# Altium project iso_simucam.PrjPCB (part 2 of 2)

## Sheet iso_power.SchDoc: Iso Power
size A3; Author: Cassio Berni; DrawnBy: CCB; Revision: 1_01; SheetNumber: 4; SheetTotal: 4
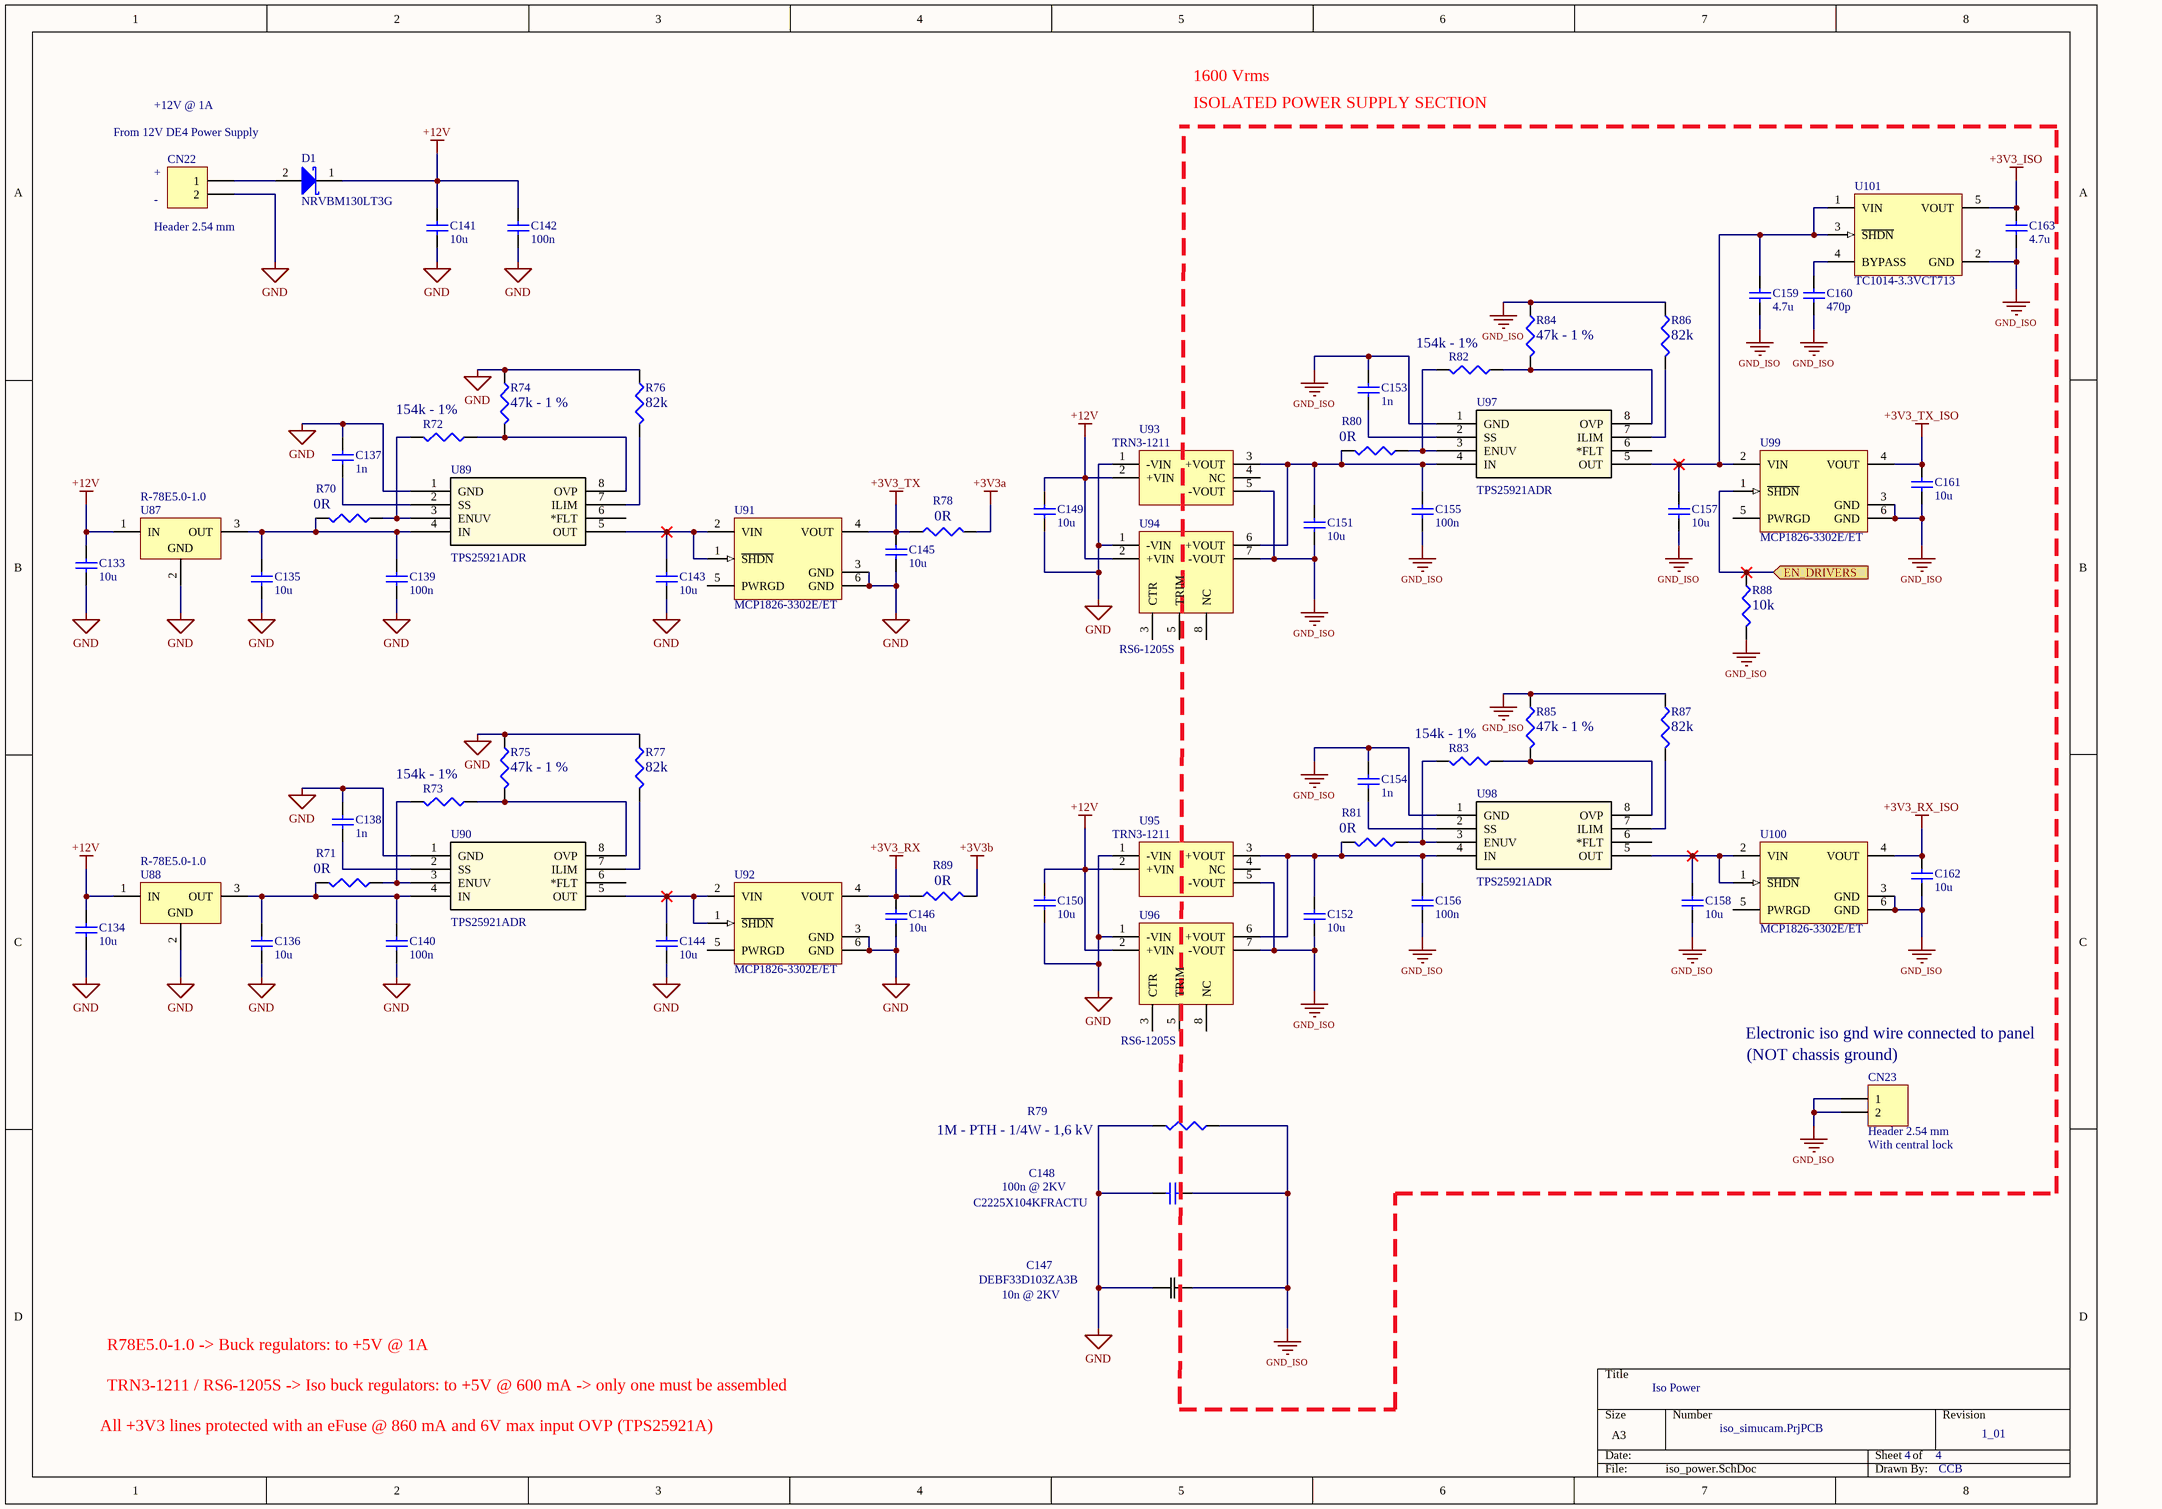
[diagram p5: iso_power.SchDoc]

### Parts
C133  Valor: 10u  [0603 - CAP - montagem na maquina]  (hidden comment: Capacitor Cerâmico SMD)
C134  Valor: 10u  [0603 - CAP - montagem na maquina]  (hidden comment: Capacitor Cerâmico SMD)
C135  Valor: 10u  [0603 - CAP - montagem na maquina]  (hidden comment: Capacitor Cerâmico SMD)
C136  Valor: 10u  [0603 - CAP - montagem na maquina]  (hidden comment: Capacitor Cerâmico SMD)
C137  Valor: 1n  [0402-cap]  (hidden comment: Capacitor Cerâmico SMD)
C138  Valor: 1n  [0402-cap]  (hidden comment: Capacitor Cerâmico SMD)
C139  Valor: 100n  [0402-cap]  (hidden comment: Capacitor Cerâmico SMD)
C140  Valor: 100n  [0402-cap]  (hidden comment: Capacitor Cerâmico SMD)
C141  Valor: 10u  [0603 - CAP - montagem na maquina]  (hidden comment: Capacitor Cerâmico SMD)
C142  Valor: 100n  [0402-cap]  (hidden comment: Capacitor Cerâmico SMD)
C143  Valor: 10u  [0603 - CAP - montagem na maquina]  (hidden comment: Capacitor Cerâmico SMD)
C144  Valor: 10u  [0603 - CAP - montagem na maquina]  (hidden comment: Capacitor Cerâmico SMD)
C145  Valor: 10u  [0603 - CAP - montagem na maquina]  (hidden comment: Capacitor Cerâmico SMD)
C146  Valor: 10u  [0603 - CAP - montagem na maquina]  (hidden comment: Capacitor Cerâmico SMD)
C147  DEBF33D103ZA3B  Valor: 10n @ 2KV  [CAP_10X4]
C148  Part Number: C2225X104KFRACTU  Valor: 100n @ 2KV  [C2225]  (hidden comment: Capacitor Cerâmico SMD)
C149  Valor: 10u  [0603 - CAP - montagem na maquina]  (hidden comment: Capacitor Cerâmico SMD)
C150  Valor: 10u  [0603 - CAP - montagem na maquina]  (hidden comment: Capacitor Cerâmico SMD)
C151  Valor: 10u  [0603 - CAP - montagem na maquina]  (hidden comment: Capacitor Cerâmico SMD)
C152  Valor: 10u  [0603 - CAP - montagem na maquina]  (hidden comment: Capacitor Cerâmico SMD)
C153  Valor: 1n  [0402-cap]  (hidden comment: Capacitor Cerâmico SMD)
C154  Valor: 1n  [0402-cap]  (hidden comment: Capacitor Cerâmico SMD)
C155  Valor: 100n  [0402-cap]  (hidden comment: Capacitor Cerâmico SMD)
C156  Valor: 100n  [0402-cap]  (hidden comment: Capacitor Cerâmico SMD)
C157  Valor: 10u  [0603 - CAP - montagem na maquina]  (hidden comment: Capacitor Cerâmico SMD)
C158  Valor: 10u  [0603 - CAP - montagem na maquina]  (hidden comment: Capacitor Cerâmico SMD)
C159  Valor: 4.7u  [0402-cap]  (hidden comment: Capacitor Cerâmico SMD)
C160  Valor: 470p  [0402-cap]  (hidden comment: Capacitor Cerâmico SMD)
C161  Valor: 10u  [0603 - CAP - montagem na maquina]  (hidden comment: Capacitor Cerâmico SMD)
C162  Valor: 10u  [0603 - CAP - montagem na maquina]  (hidden comment: Capacitor Cerâmico SMD)
C163  Valor: 4.7u  [0402-cap]  (hidden comment: Capacitor Cerâmico SMD)
CN22  Valor: Header 2.54 mm  [HDR1X2]  (hidden comment: Header 2)
CN23  Valor: Header 2.54 mm  [HDR1X2]  (hidden comment: Header 2)
D1  NRVBM130LT3G  [D0-216AA]
R70  Valor: 0R  [0402-res]  (hidden comment: Res3)
R71  Valor: 0R  [0402-res]  (hidden comment: Res3)
R72  Valor: 154k - 1%  [0402-res]  (hidden comment: Res3)
R73  Valor: 154k - 1%  [0402-res]  (hidden comment: Res3)
R74  Valor: 47k - 1 %  [0402-res]  (hidden comment: Res3)
R75  Valor: 47k - 1 %  [0402-res]  (hidden comment: Res3)
R76  Valor: 82k  [0402-res]  (hidden comment: Res3)
R77  Valor: 82k  [0402-res]  (hidden comment: Res3)
R78  Valor: 0R  [0402-res]  (hidden comment: Res3)
R79  Valor: 1M - PTH - 1/4W - 1,6 kV  [CR25]  (hidden comment: Res3)
R80  Valor: 0R  [0402-res]  (hidden comment: Res3)
R81  Valor: 0R  [0402-res]  (hidden comment: Res3)
R82  Valor: 154k - 1%  [0402-res]  (hidden comment: Res3)
R83  Valor: 154k - 1%  [0402-res]  (hidden comment: Res3)
R84  Valor: 47k - 1 %  [0402-res]  (hidden comment: Res3)
R85  Valor: 47k - 1 %  [0402-res]  (hidden comment: Res3)
R86  Valor: 82k  [0402-res]  (hidden comment: Res3)
R87  Valor: 82k  [0402-res]  (hidden comment: Res3)
R88  Valor: 10k  [0402-res]  (hidden comment: Res3)
R89  Valor: 0R  [0402-res]  (hidden comment: Res3)
U87  R-78E5.0-1.0  [TO-220]
U88  R-78E5.0-1.0  [TO-220]
U89  TPS25921ADR  [D8]
U90  TPS25921ADR  [D8]
U91  MCP1826-3302E/ET  [DDPAK-ET5_N]
U92  MCP1826-3302E/ET  [DDPAK-ET5_N]
U93  TRN3-1211  [TRN3]
U94  RS6-1205S  [RS6]
U95  TRN3-1211  [TRN3]
U96  RS6-1205S  [RS6]
U97  TPS25921ADR  [D8]
U98  TPS25921ADR  [D8]
U99  MCP1826-3302E/ET  [DDPAK-ET5_N]
U100  MCP1826-3302E/ET  [DDPAK-ET5_N]
U101  TC1014-3.3VCT713  [SOT-23-CT5_N]

### Ports
EN_DRIVERS (in)

### Nets
+3V3_ISO: C163.2 U101.5(VOUT)
+3V3_RX: C146.2 R89.1 U92.4(VOUT)
+3V3_RX_ISO: C162.2 U100.4(VOUT)
+3V3_TX: C145.2 R78.1 U91.4(VOUT)
+3V3_TX_ISO: C161.2 U99.4(VOUT)
+3V3a: R78.2
+3V3b: R89.2
+12V: C133.2 C134.2 C141.2 C142.2 C149.2 C150.2 D1.1(K) U87.1(IN) U88.1(IN) U93.2(+VIN) U94.2(+VIN) U95.2(+VIN) U96.2(+VIN)
GND: C133.1 C134.1 C135.1 C136.1 C137.1 C138.1 C139.1 C140.1 C141.1 C142.1 C143.1 C144.1 C145.1 C146.1 C147.1 C148.1 C149.1 C150.1 CN22.2 R74.1 R75.1 R76.1 R77.1 R79.2 U87.2(GND) U88.2(GND) U89.1(GND) U90.1(GND) U91.3(GND) U91.6(GND) U92.3(GND) U92.6(GND) U93.1(-VIN) U94.1(-VIN) U95.1(-VIN) U96.1(-VIN)
GND_ISO: C147.2 C148.2 C151.1 C152.1 C153.1 C154.1 C155.1 C156.1 C157.1 C158.1 C159.1 C160.1 C161.1 C162.1 C163.1 CN23.1 CN23.2 R79.1 R84.1 R85.1 R86.1 R87.1 R88.2 U93.5(-VOUT) U94.7(-VOUT) U95.5(-VOUT) U96.7(-VOUT) U97.1(GND) U98.1(GND) U99.3(GND) U99.6(GND) U100.3(GND) U100.6(GND) U101.2(GND)
NetC135_2: C135.2 C139.2 R70.2 U87.3(OUT) U89.4(IN)
NetC136_2: C136.2 C140.2 R71.2 U88.3(OUT) U90.4(IN)
NetC137_2: C137.2 U89.2(SS)
NetC138_2: C138.2 U90.2(SS)
NetC143_2: C143.2 U89.5(OUT) U91.1(~{SHDN}) U91.2(VIN)
NetC144_2: C144.2 U90.5(OUT) U92.1(~{SHDN}) U92.2(VIN)
NetC151_2: C151.2 C155.2 R80.2 U93.3(+VOUT) U94.6(+VOUT) U97.4(IN)
NetC152_2: C152.2 C156.2 R81.2 U95.3(+VOUT) U96.6(+VOUT) U98.4(IN)
NetC153_2: C153.2 U97.2(SS)
NetC154_2: C154.2 U98.2(SS)
NetC157_2: C157.2 C159.2 U97.5(OUT) U99.2(VIN) U101.1(VIN) U101.3(~{SHDN})
NetC158_2: C158.2 U98.5(OUT) U100.1(~{SHDN}) U100.2(VIN)
NetC160_2: C160.2 U101.4(BYPASS)
NetCN22_1: CN22.1 D1.2(A)
NetR67_2: R88.1 U99.1(~{SHDN}) ; port EN_DRIVERS
NetR70_1: R70.1 R72.2 U89.3(ENUV)
NetR71_1: R71.1 R73.2 U90.3(ENUV)
NetR72_1: R72.1 R74.2 U89.8(OVP)
NetR73_1: R73.1 R75.2 U90.8(OVP)
NetR76_2: R76.2 U89.7(ILIM)
NetR77_2: R77.2 U90.7(ILIM)
NetR80_1: R80.1 R82.2 U97.3(ENUV)
NetR81_1: R81.1 R83.2 U98.3(ENUV)
NetR82_1: R82.1 R84.2 U97.8(OVP)
NetR83_1: R83.1 R85.2 U98.8(OVP)
NetR86_2: R86.2 U97.7(ILIM)
NetR87_2: R87.2 U98.7(ILIM)

Not connected (* = marked no-connect by the designer): U89 6(*FLT); U90 6(*FLT); U91 5(PWRGD); U92 5(PWRGD); U93 4(NC); U94 3(CTR) 5(TRIM) 8(NC); U95 4(NC); U96 3(CTR) 5(TRIM) 8(NC); U97 6(*FLT); U98 6(*FLT); U99 5(PWRGD); U100 5(PWRGD)

### Notes on the sheet
- +12V @ 1A
- ISOLATED POWER SUPPLY SECTION
- 1600 Vrms
- From 12V DE4 Power Supply
- (near CN22) +
- (near CN22) -
- Electronic iso gnd wire connected to panel
- (near CN23) (NOT chassis ground)
- (near CN23) With central lock
- R78E5.0-1.0 -> Buck regulators: to +5V @ 1A
- TRN3-1211 / RS6-1205S -> Iso buck regulators: to +5V @ 600 mA -> only one must be assembled
- All +3V3 lines protected with an eFuse @ 860 mA and 6V max input OVP (TPS25921A)

### Library data of the parts
C147 = DEBF33D103ZA3B: Imported; Vendor: Murata; Built_By: EMA_UL_Team; C: Copyright (C) 2015 Accelerated Designs. All rights reserved; Manufacturer_Part_Number: DEBF33D103ZA3B; Value: Value
CN22 CN23 = Header 2: Header, 2-Pin; LatestRevisionDate: 17-Jul-2002; LatestRevisionNote: Re-released for DXP Platform.; Publisher: Altium Limited
D1 = NRVBM130LT3G: Surface Mount  Schottky Power Rectifier - 1.0 AMPERES, 30 VOLTS; Fabricante: On Semi; Encapsulamento: D0-216AA
R70-R78 R80-R89 = Res3: Resistor; Grupo: 01
R79 = Res3: Resistor; Part number: VR25000001004FA100; Grupo: 01
U87 U88 = R-78E5.0-1.0: 3-Terminal Positive dc-dc regulator - 5V @ 1A; Valor: 5V ; 1A; Encapsulamento: TO-220
U89 U90 U97 U98 = TPS25921ADR: Imported; Vendor: Texas Instruments; Built_By: EMA_UL_Team; C: Copyright (C) 2016 Accelerated Designs. All rights reserved; Manufacturer_Part_Number: TPS25921ADR; Value: Value; Type: Type; RefDes: RefDes
U91 U92 U99 U100 = MCP1826-3302E/ET: 1000 mA, Low Voltage, Low Quiescent Current LDO Regulator, 5-Pin DDPAK, Extended Temperature; Manufacturer: Microchip; DatasheetVersion: revA, Aug-2007; PackageVersion: revBB, Aug-2009; PackageReference: DDPAK-ET5; PackageDescription: 5-Lead Plastic (ET) [DDPAK]; Supplier 1: Digi-Key; Supplier Part Number 1: MCP1826-3302E/ET-ND; Supplier 2: Newark; Supplier Part Number 2: 27M0017; Supplier 3: Mouser; Supplier Part Number 3: 579-MCP1826-3302E/ET; Mounting Technology: Surface Mount; PartNumber: MCP1826-3302E/ET; ComponentLink1Description: Manufacturer URL; ComponentLink1URL: http://www.microchip.com/; ComponentLink2Description: Datasheet; ComponentLink2URL: http://ww1.microchip.com/downloads/en/DeviceDoc/22057a.pdf; ComponentLink3Description: Package Specification; ComponentLink3URL: http://www.microchip.com/stellent/groups/techpub_sg/documents/packagingspec/en012702.pdf
U93 U95 = TRN3-1211: 4-Terminal Positive dc-dc iso regulator - 5V @ 0,6A; Valor: 5V ; 0,6A; Encapsulamento: TRN3
U94 U96 = RS6-1205S: 8-Terminal Positive dc-dc iso regulator - 5V @ 1,2A; Valor: 5V ; 1,2A; Encapsulamento: RS6
U101 = TC1014-3.3VCT713: 50 mA, 100 mA and 150 mA CMOS LDOs with Active-Low Shutdown and Reference Bypass, 5-Pin SOT-23, Extended Temperature, Tape and Reel; Manufacturer: Microchip; DatasheetVersion: revE, Feb-2007; PackageVersion: revBB, Aug-2009; PackageReference: SOT-23-CT5; PackageDescription: 5-Lead Plastic Small Outline Transistor (CT) [SOT-23]; Supplier 1: Digi-Key; Supplier Part Number 1: TC1014-3.3VCT713TR-ND; Supplier 2: Digi-Key; Supplier Part Number 2: TC1014-3.3VCT713CT-ND; Supplier 3: Digi-Key; Supplier Part Number 3: TC1014-3.3VCT713DKR-ND; Supplier 4: Farnell; Supplier Part Number 4: 1331502RL; Supplier 5: Farnell; Supplier Part Number 5: 1331502; Supplier 6: Newark; Supplier Part Number 6: 61K3534; Supplier 7: Mouser; Supplier Part Number 7: 579-TC1014-3.3VCT713; Mounting Technology: Surface Mount; Code_IPC: SOT23-5; PartNumber: TC1014-3.3VCT713; ComponentLink1Description: Manufacturer URL; ComponentLink1URL: http://www.microchip.com/; ComponentLink2Description: Datasheet; ComponentLink2URL: http://ww1.microchip.com/downloads/en/DeviceDoc/21335e.pdf; ComponentLink3Description: Package Specification; ComponentLink3URL: http://www.microchip.com/stellent/groups/techpub_sg/documents/packagingspec/en012702.pdf

## Nets that join several sheets
+3V3_ISO: iso_sincs (C131.1 C132.2 U83.16 U84.8), iso_power (C163.2 U101.5)
+3V3_RX: iso_lvds_rx (16 pins), iso_power (C146.2 R89.1 U92.4)
+3V3_RX_ISO: iso_lvds_rx (16 pins), iso_power (C162.2 U100.4)
+3V3_TX: iso_lvds_tx (16 pins), iso_power (C145.2 R78.1 U91.4)
+3V3_TX_ISO: iso_lvds_tx (16 pins), iso_power (C161.2 U99.4)
+3V3a: iso_sincs (C130.1 U84.1 U84.3), iso_power (R78.2)
+3V3b: iso_sincs (C129.2 U83.1 U83.7), iso_power (R89.2)
GND: iso_lvds_tx (72 pins), iso_lvds_rx (80 pins), iso_sincs (13 pins), iso_power (36 pins)
GND_ISO: iso_lvds_tx (72 pins), iso_lvds_rx (80 pins), iso_sincs (8 pins), iso_power (34 pins)
NetR67_2: iso_sincs (R67.2 U83.10 U84.6), iso_power (R88.1 U99.1)